# EAGLE design driverboard-v1 (EAGLE 7.1.0)
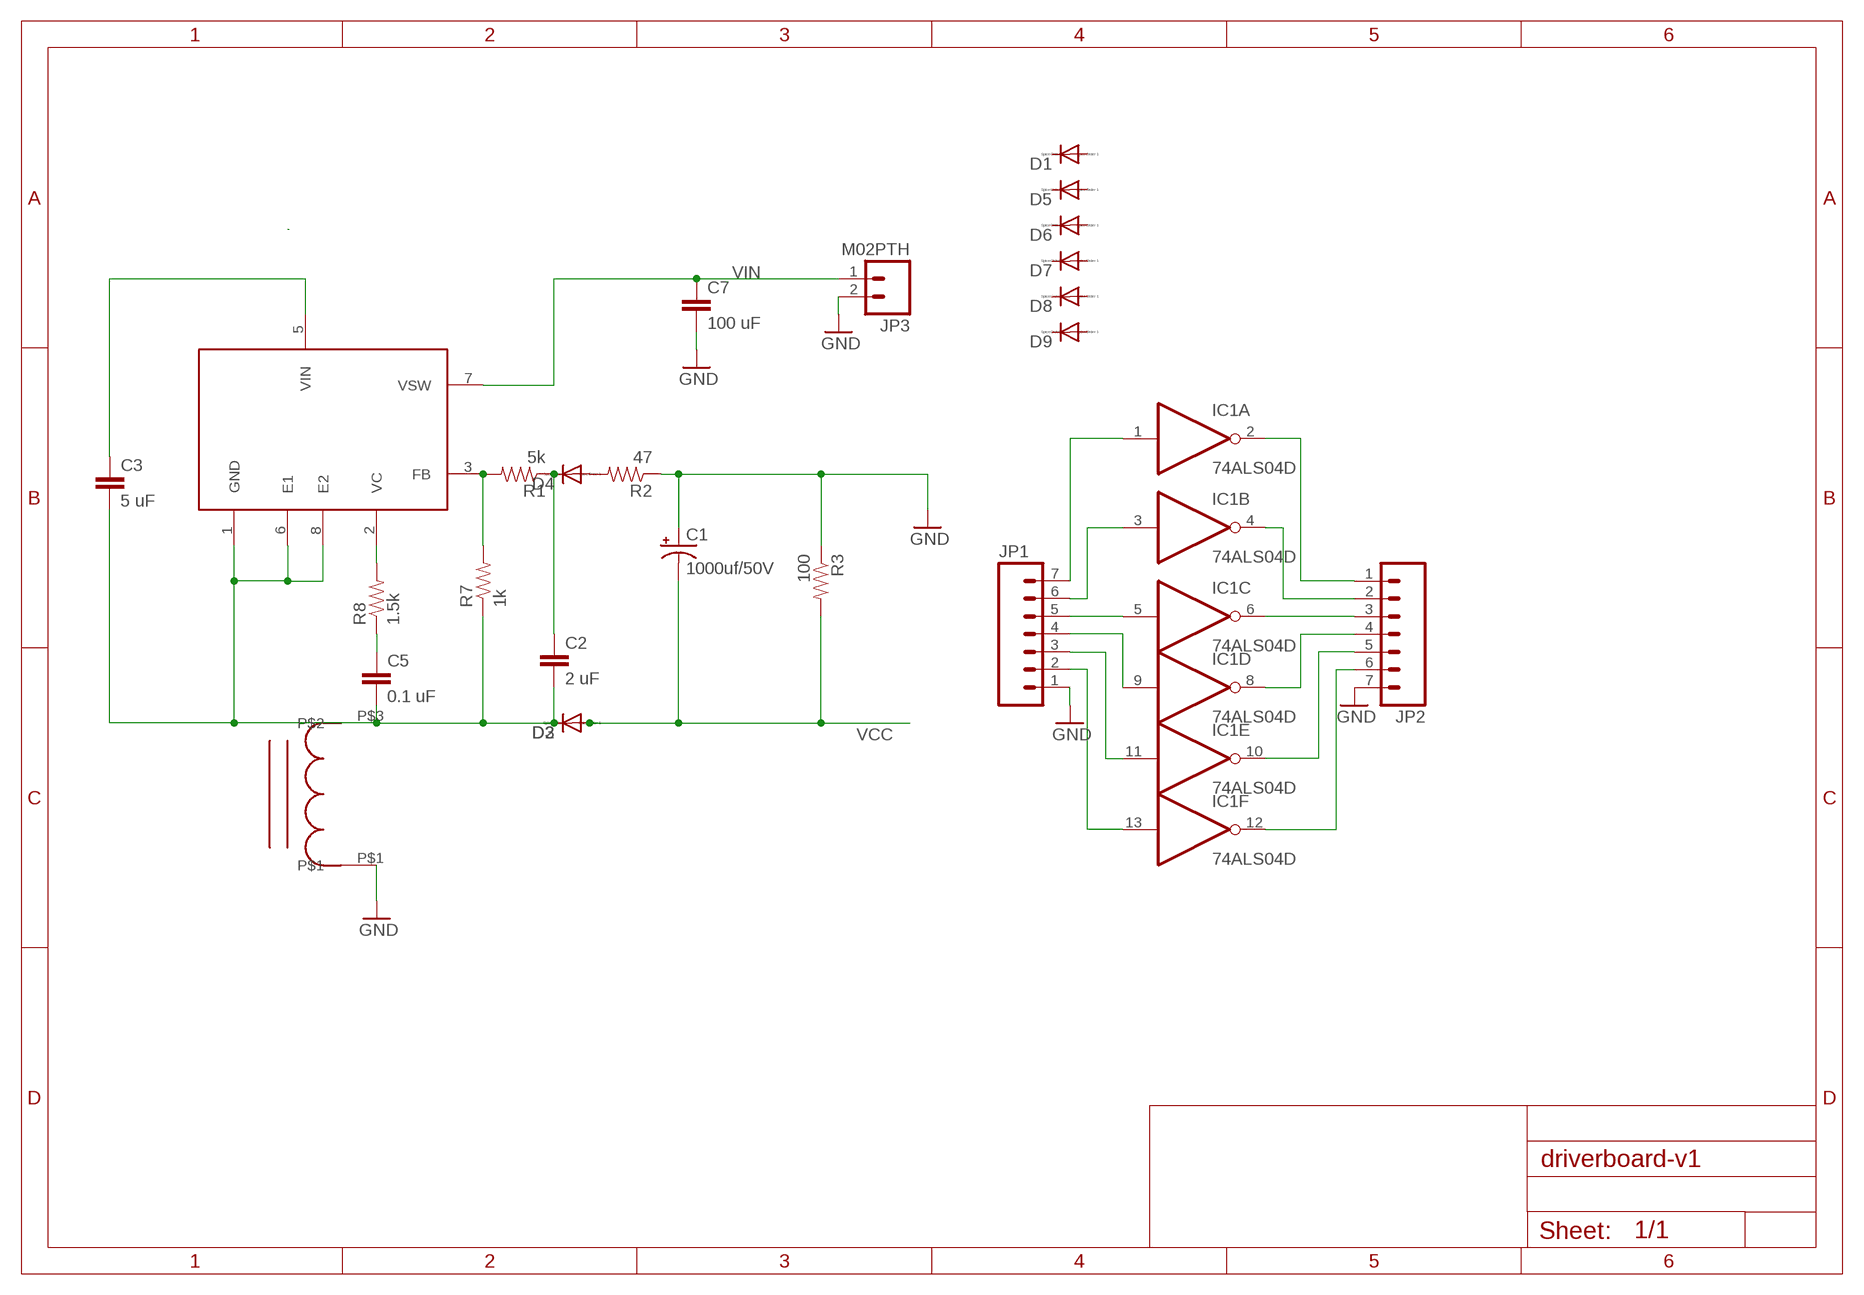
[diagram p0: schematic, sheet 1]

## Parts
C1  1000uf/50V  1000UF-25V(PTH)KIT  [CPOL-RADIAL-1000UF-25V-KIT]
C2  2 uF  CAP0805  [0805]
C3  5 uF  CAP0805  [0805]
C5  0.1 uF  CAP0805  [0805]
C7  100 uF  CAP1206  [1206]
D1  DIODE-DO-214AC  [DO-214AC]
D2  DIODE-DO-214AC  [DO-214AC]
D3  DIODE-DO-214AC  [DO-214AC]
D4  DIODE-DO-214AC  [DO-214AC]
D5  DIODE-DO-214AC  [DO-214AC]
D6  DIODE-DO-214AC  [DO-214AC]
D7  DIODE-DO-214AC  [DO-214AC]
D8  DIODE-DO-214AC  [DO-214AC]
D9  DIODE-DO-214AC  [DO-214AC]
IC1  74ALS04D  [SO14]
JP1  M07  [1X07]
JP2  M07  [1X07]
JP3  M02PTH  [1X02]
L2  52626-L  [52626-L]
R1  5k  RESISTOR0603  [0603-RES]
R2  47  RESISTOR0603  [0603-RES]
R3  100  RESISTOR0603  [0603-RES]
R7  1k  RESISTOR0603  [0603-RES]
R8  1.5k  RESISTOR0603  [0603-RES]
U3  1072-BOOST  [1072-BOOST]

## Nets
GND: C1.+ C7.2 JP1.1 JP2.7 JP3.2 L2.P$1 R2.1 R3.1
N$3: IC1.1(A:I) JP1.7
N$4: R1.2 R7.2 U3.3(FB)
N$10: C2.1 D4.C R1.1
N$11: C3.1 U3.5(VIN)
N$13: C5.1 R8.1
N$14: D4.A R2.2
N$15: C2.2 C3.2 C5.2 D2.C D3.C L2.P$3 R7.1 U3.1(GND) U3.6(E1) U3.8(E2)
N$16: IC1.3(B:I) JP1.6
N$17: IC1.5(C:I) JP1.5
N$18: IC1.9(D:I) JP1.4
N$19: IC1.11(E:I) JP1.3
N$20: IC1.13(F:I) JP1.2
N$21: IC1.12(F:O) JP2.6
N$22: IC1.10(E:O) JP2.5
N$23: IC1.8(D:O) JP2.4
N$24: IC1.6(C:O) JP2.3
N$25: IC1.4(B:O) JP2.2
N$26: IC1.2(A:O) JP2.1
N$29: R8.2 U3.2(VC)
VCC: C1.- D2.A D3.A R3.2
VIN: C7.1 JP3.1 U3.7(VSW)
Unconnected: D1.A D1.C D5.A D5.C D6.A D6.C D7.A D7.C D8.A D8.C D9.A D9.C

## Power pins joined to a net without a drawn wire
GND: IC1.7(P:GND)
VCC: IC1.14(P:VCC)

## Library data of the parts
C1 = SparkFun-Capacitors:1000UF-25V(PTH): CAP-08070; PROD_ID: CAP-09538; VALUE: 1000uf/25V
C2 C3 C5 C7 = SparkFun-Capacitors:CAP: Capacitor Standard 0603 ceramic capacitor, and 0.1" leaded capacitor.
D1-D9 = diode:DIODE-: DIODE
IC1 = 74xx-us:74*04: Hex INVERTER
JP1 JP2 = SparkFun-Connectors:M07: Header 7 Standard 7-pin 0.1" header. Use with straight break away headers (SKU : PRT-00116), right angle break away headers (PRT-00553), swiss pins (PRT-00743), machine pins (PRT-00117), and female headers (PRT-00115). NOTES ON THE VARIANTS LOCK and LOCK_LONGPADS... This footprint was designed to help hold the alignment of a through-hole component (i.e. 7-pin header) while soldering it into place. You may notice that each hole has been shifted either up or down by 0.005 of an inch from it's more standard position (which is usually a perfectly straight line). This slight alteration caused the pins (the squares in the middle) to touch the edges of the holes. Because they are alternating, it causes a "brace" to hold the header in place. 0.005 has proven to be the perfect amount of "off-center" position when using our standard breakaway headers. Although looks a little odd when you look at the bare footprint, once you have a header in there, the alteration is very hard to notice. Also, if you push a header all the way into place, it is covered up entirely on the bottom side. This idea of altering the position of holes to aid alignment will be further integrated into the Sparkfun Library for other footprints. It can help hold any component with 3 or more connection pins.
JP3 = SparkFun-Connectors:M02: Standard 2-pin 0.1" header. Use with - straight break away headers ( PRT-00116) - right angle break away headers (PRT-00553) - swiss pins (PRT-00743) - machine pins (PRT-00117) - female headers (PRT-00115) Molex polarized connector foot print use with: PRT-08233 with associated crimp pins and housings. 2.54_SCREWTERM for use with PRT-10571. 3.5mm Screw Terminal footprints for PRT-08084 5mm Screw Terminal footprints for use with PRT-08432
L2 = spietz-library:52626-L
R1-R3 R7 R8 = SparkFun-Resistors:RESISTOR: Resistor Basic schematic elements and footprints for 0603, 1206, and PTH resistors.
U3 = spietz-library:1072-BOOST

## Net classes
1 vcc: width 0.254 mm

## Board
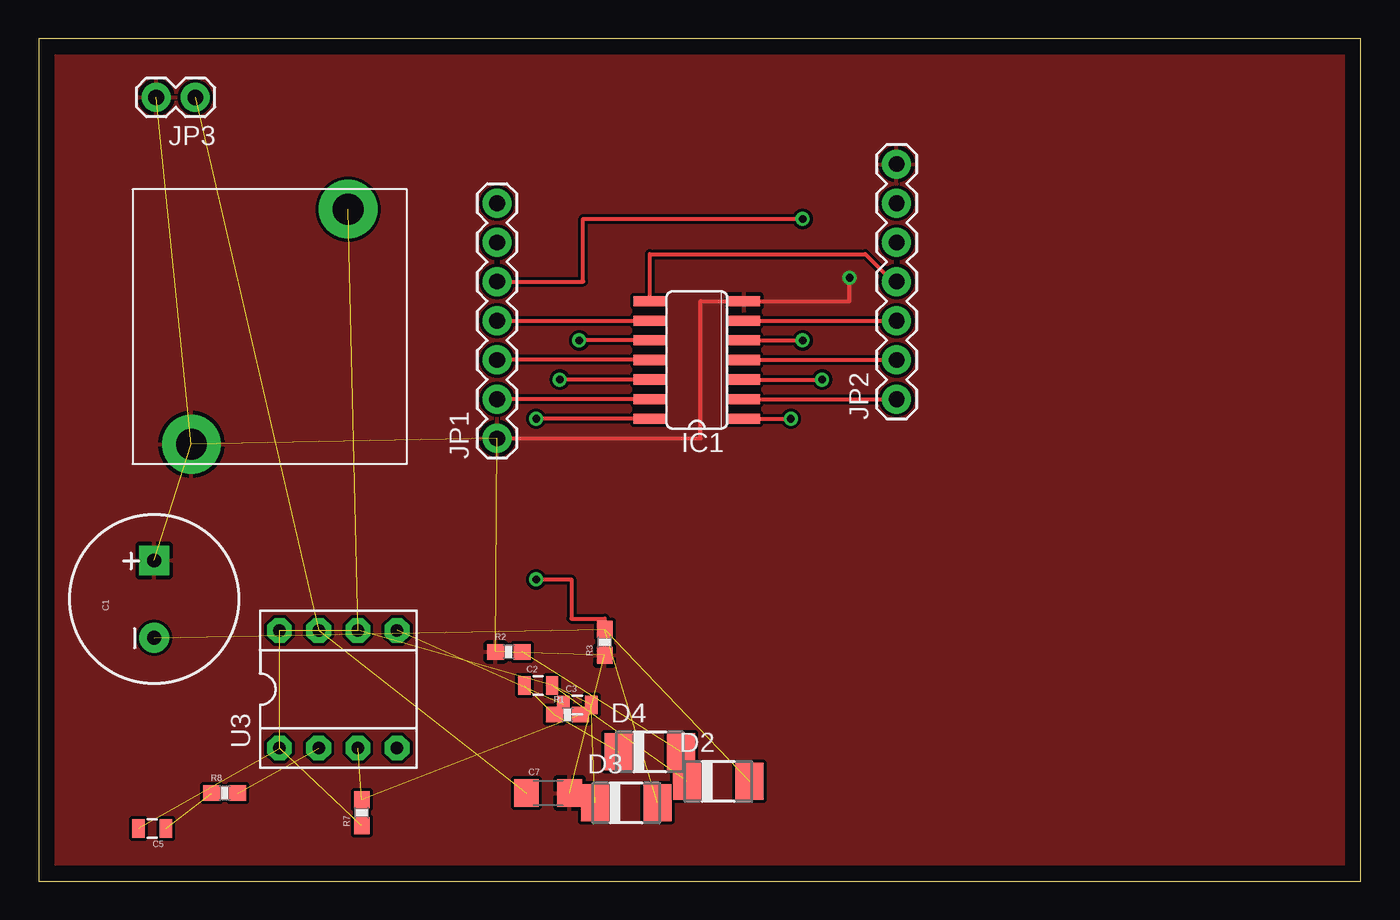
[diagram p1: board, top side]
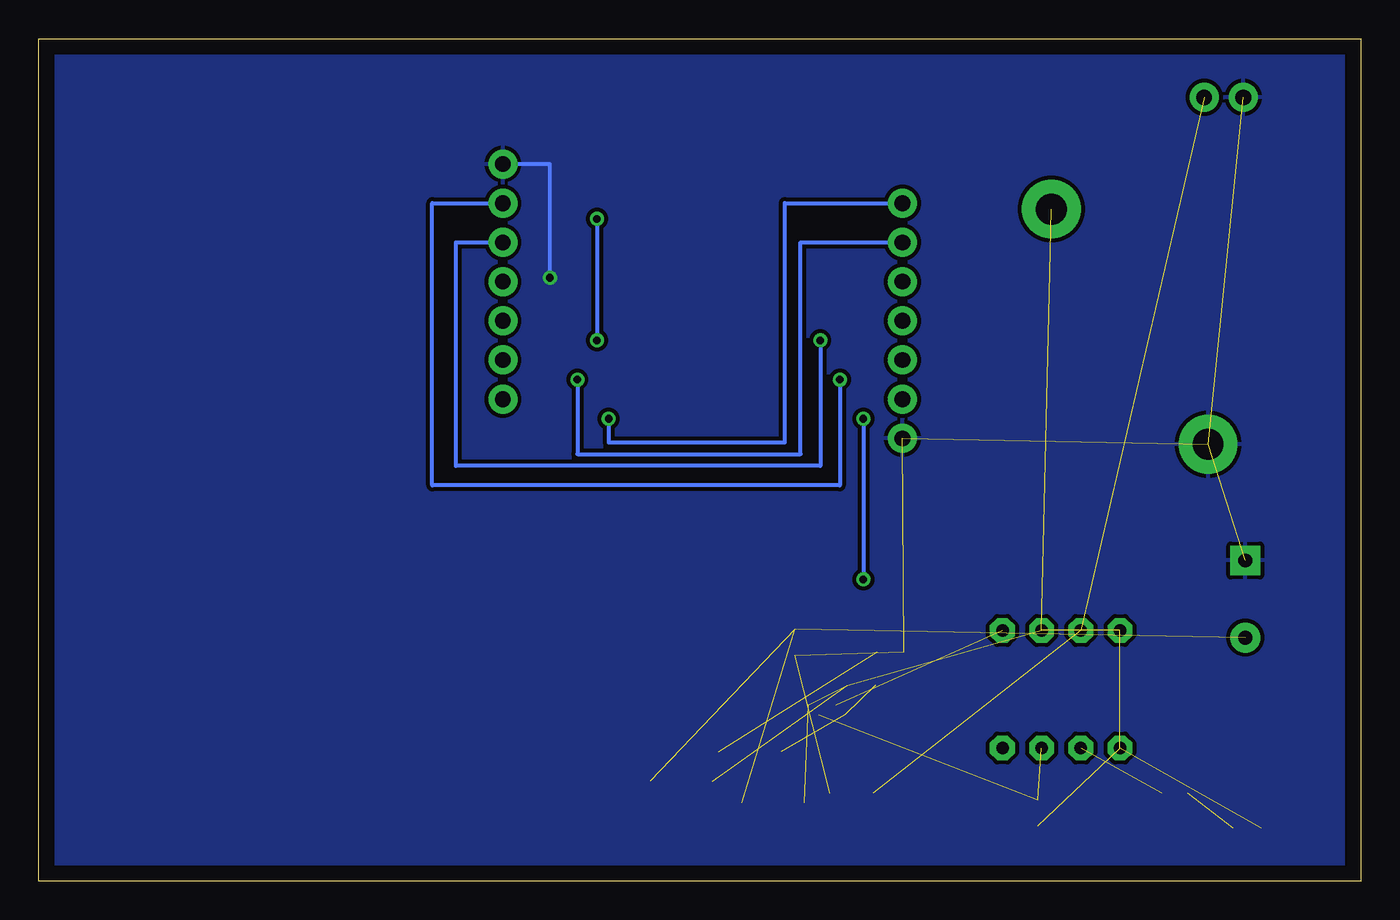
[diagram p2: board, bottom side, seen from below]

Size 85.72 x 54.61 mm. Coordinates in mm from the lower left corner, seen from the top.
Outline: 0,0 85.72,0 85.72,54.61 0,54.61 0,0
Copper layers (1*16): Top 0.035mm / dielectric 1.5mm / Bottom 0.035mm
Design rules "default": minimum track width 10mil, minimum drill 24mil, track to track 8mil, track to pad 8mil, pad to pad 8mil, via to via 8mil, smd to smd 8mil, copper to edge 40mil, drill to drill 8mil, minimum pad ring 10mil, minimum via ring 8mil, stop-mask expansion 4mil, vias tented up to drill 0mil, thermal gap 10mil

### Footprints (pad centres in the part's own frame; a part is rotated, then mirrored left to right if it is on the bottom)
CPOL-RADIAL-1000UF-25V-KIT = drill 0.9 pad 1.93 square: + 2.5,0 | drill 0.9 pad 1.93: - -2.5,0
0805 = smd 0.8 x 1.2: 1 -0.9,0; 2 0.9,0
1206 = smd 1.6 x 1.8: 1 -1.4,0; 2 1.4,0
DO-214AC = smd 1.8 x 2.4: A 2.025,0; C -2.025,0
SO14 = smd 0.66 x 2.032: 1 -3.81,-3.073; 2 -2.54,-3.073; 3 -1.27,-3.073; 4 0,-3.073; 5 1.27,-3.073; 6 2.54,-3.073; 7 3.81,-3.073; 8 3.81,3.073; 9 2.54,3.073; 10 1.27,3.073; 11 0,3.073; 12 -1.27,3.073; 13 -2.54,3.073; 14 -3.81,3.073
1X07 = drill 1.016 pad 1.88: 1 0,0; 2 2.54,0; 3 5.08,0; 4 7.62,0; 5 10.16,0; 6 12.7,0; 7 15.24,0
1X02 = drill 1.016 pad 1.88: 1 0,0; 2 2.54,0
52626-L = drill 2 pad 3.81: P$1 3.81,1.27; P$3 13.97,16.51
0603-RES = smd 1.1 x 1: 1 -0.85,0; 2 0.85,0
1072-BOOST = drill 0.813 pad 1.6 octagon: 1 -3.81,-3.81; 2 -1.27,-3.81; 3 1.27,-3.81; 4 3.81,-3.81; 5 3.81,3.81; 6 1.27,3.81; 7 -1.27,3.81; 8 -3.81,3.81

### Placement (x,y rotation side)
C1  7.49,18.29 90 top
C2  32.38,12.7 0 top
C3  34.92,11.43 0 top
C5  7.37,3.43 180 top
C7  33.02,5.71 0 top
D1  0.51,-6.35 0 top  (outside the outline)
D2  44.07,6.48 0 top
D3  38.1,5.08 0 top
D4  39.62,8.38 0 top
D5  0.51,-11.43 0 top  (outside the outline)
D6  0.51,-16.51 0 top  (outside the outline)
D7  0.51,-21.59 0 top  (outside the outline)
D8  0.51,-26.67 0 top  (outside the outline)
D9  0.51,-31.75 0 top  (outside the outline)
IC1  42.67,33.78 90 top
JP1  29.72,28.7 90 top
JP2  55.63,31.24 90 top
JP3  10.16,50.8 180 top
L2  6.1,27.05 0 top
R1  34.29,10.79 0 top
R2  30.48,14.86 0 top
R3  36.7,15.49 90 top
R7  20.95,4.45 90 top
R8  12.06,5.71 0 top
U3  19.43,12.45 0 top

### Tracks (layer width: path | path; a pad name or v marks a point on that pad's centre or on a via)
GND  (via drill 0.5)  (6 unrouted)
  Top 0.254: v52.58,39.12 52.58,37.59 IC1.7 42.93,37.59 42.93,28.7 JP1.1
  Bottom 0.254: v52.58,39.12 52.58,46.48 JP2.7
  pour Top (isolate 0.152): -1.27,61.72 -1.27,-1.27 89.92,-1.27 89.92,61.98
  pour Bottom (isolate 0.254): -2.54,62.36 -2.54,-2.54 93.22,-2.54 93.22,62.36
N$3  (via drill 0.5)
  Top 0.254: IC1.1 v48.77,29.97
  Bottom 0.254: v48.77,29.97 48.77,28.45 37.34,28.45 37.34,43.94 JP1.7
N$4  (2 unrouted)
N$10  (2 unrouted)
N$11  (1 unrouted)
N$13  (1 unrouted)
N$14  (1 unrouted)
N$15  (9 unrouted)
N$16  (via drill 0.5)
  Top 0.254: IC1.3 v50.8,32.51
  Bottom 0.254: v50.8,32.51 50.8,27.69 36.32,27.69 36.32,41.4 JP1.6
N$17  (via drill 0.5)
  Top 0.254: JP1.5 35.31,38.86 35.31,42.93 v49.53,42.93 | IC1.5 v49.53,35.05
  Bottom 0.254: v49.53,42.93 v49.53,35.05
N$18
  Top 0.254: JP1.4 IC1.9
N$19
  Top 0.254: IC1.11 JP1.3
N$20
  Top 0.254: IC1.13 JP1.2
N$21  (via drill 0.5)
  Top 0.254: IC1.12 v33.78,32.51
  Bottom 0.254: v33.78,32.51 33.78,25.65 60.2,25.65 60.2,43.94 JP2.6
N$22  (via drill 0.5)
  Top 0.254: IC1.10 v35.05,35.05
  Bottom 0.254: v35.05,35.05 35.05,26.92 58.67,26.92 58.67,41.4 JP2.5
N$23
  Top 0.254: IC1.8 39.62,37.59 39.62,40.64 53.59,40.64 55.37,38.86 JP2.4
N$24
  Top 0.254: IC1.6 JP2.3
N$25
  Top 0.254: IC1.4 JP2.2
N$26
  Top 0.254: IC1.2 JP2.1
N$29  (1 unrouted)
VCC  (via drill 0.5)  (3 unrouted)
  Top 0.254: IC1.14 v32.26,29.97 | v32.26,19.56 34.54,19.56 34.54,17.02 36.7,17.02 R3.2
  Bottom 0.254: v32.26,29.97 v32.26,19.56
VIN  (2 unrouted)